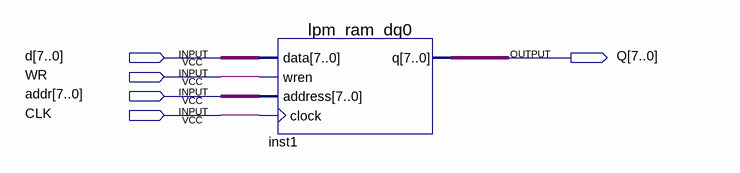
[diagram p0: schematic sheet]
// Quartus schematic RAM.bdf as structural Verilog: 1 symbols, 5 pins
module RAM (
  input  [7:0] d,
  input  WR,
  input  [7:0] addr,
  input  CLK,
  output [7:0] Q
);

  lpm_ram_dq0 inst1 (.data(d), .wren(WR), .address(addr), .clock(CLK), .q(Q));
endmodule
